# EAGLE design Raspi_Photometer (EAGLE 7.3.0)
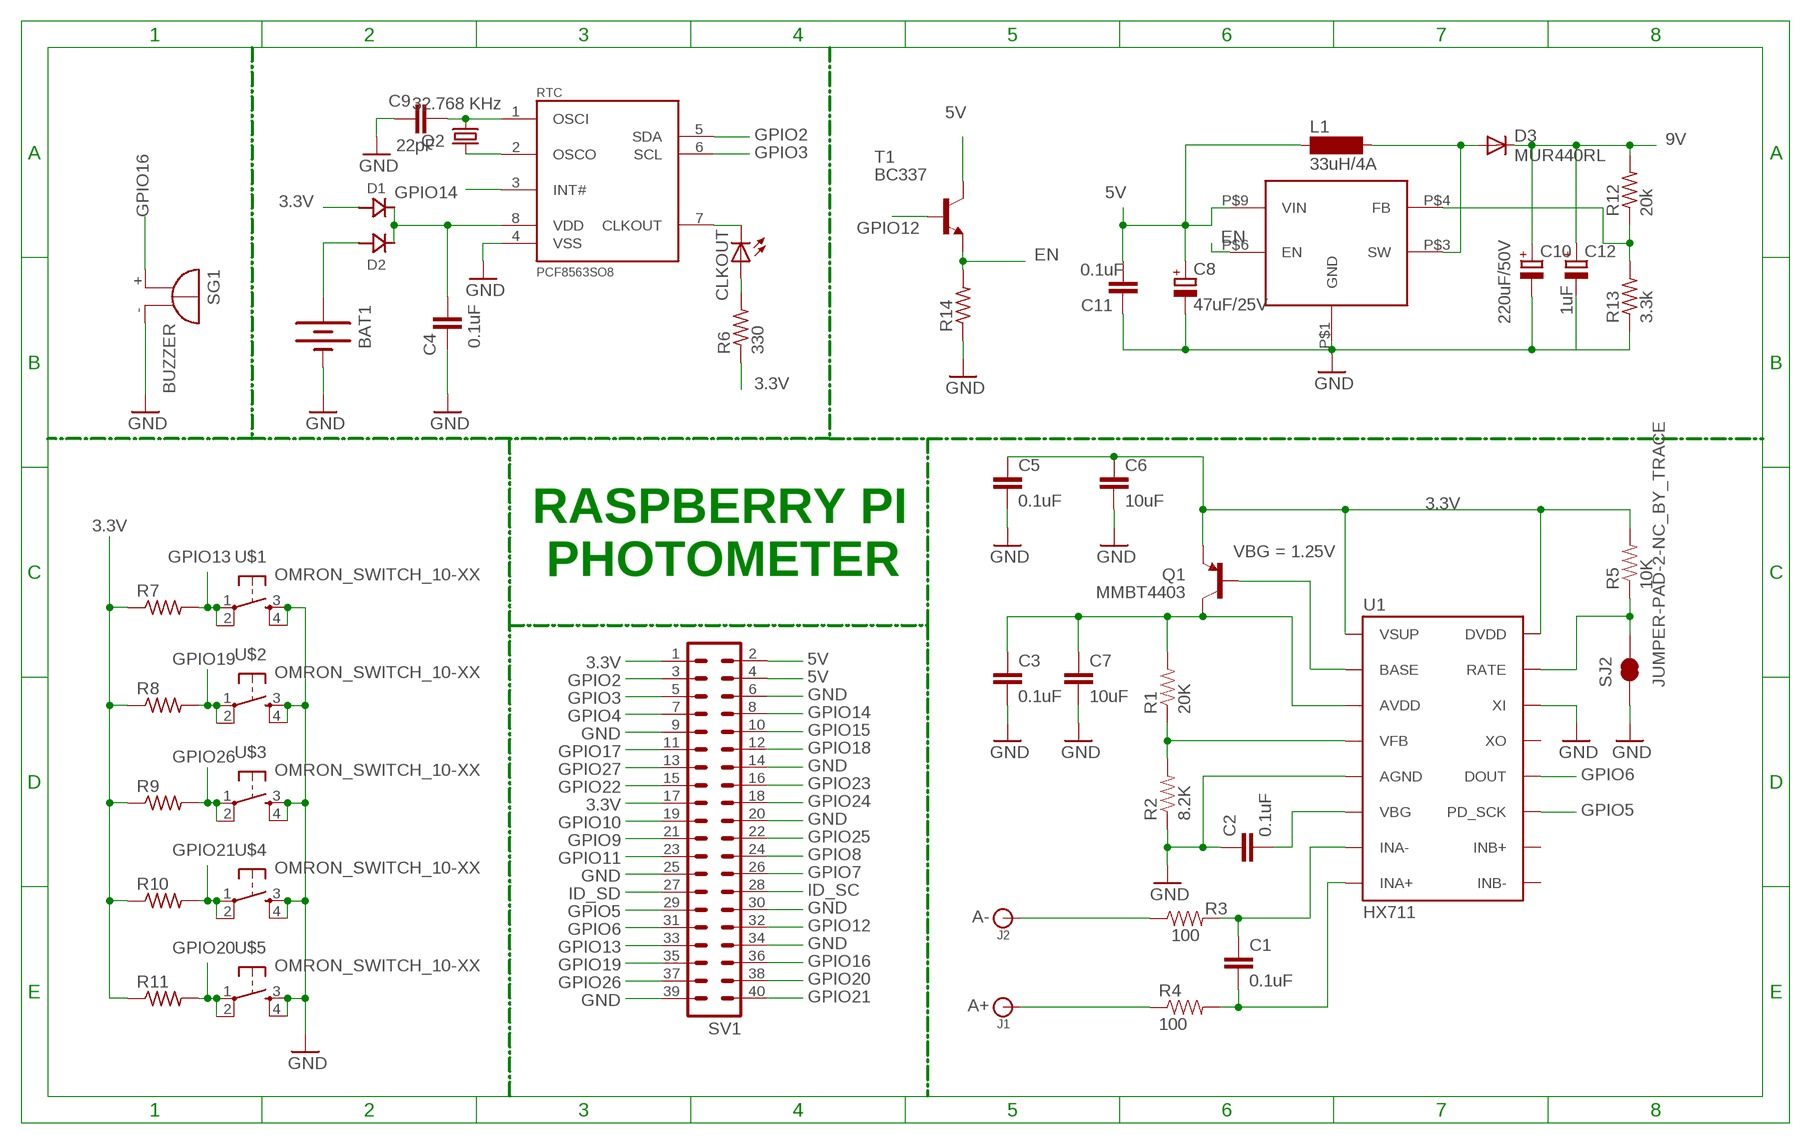
[diagram p0: schematic, sheet 1]

## Parts
BAT1  BATTERY20PTH  [BATTCOM_20MM_PTH]
C1  0.1uF  0.1UF-25V-5%(0603)  [0603-CAP]
C2  0.1uF  0.1UF-25V-5%(0603)  [0603-CAP]
C3  0.1uF  0.1UF-25V-5%(0603)  [0603-CAP]
C4  0.1uF  C-EUC0805K  [C0805K]
C5  0.1uF  0.1UF-25V-5%(0603)  [0603-CAP]
C6  10uF  10UF50V20%(1210)  [1210]
C7  10uF  10UF50V20%(1210)  [1210]
C8  47uF/25V  CPOL-EUE3.5-10  [E3,5-10]
C9  22pF  C-EUC0805K  [C0805K]
C10  220uF/50V  CPOL-EUE5-10.5  [E5-10,5]
C11  0.1uF  C-EUC0603  [C0603]
C12  1uF  CPOL-EUE2.5-5  [E2,5-5]
CLKOUT  LED0805  [CHIPLED_0805]
D1  SS14  [DO214]
D2  SS14  [DO214]
D3  MUR440RL  [C2673]
J1  BANANA_CONN  [BANANA_CONN]
J2  BANANA_CONN  [BANANA_CONN]
L1  33uH/4A  MS85  [MS85]
Q1  MMBT4403  TRANSISTOR_PNPMMBT4403  [SOT23-3]
Q2  32.768 KHz  CRYSTALTC26H  [TC26H]
R1  20K  20KOHM1/10W1%(0603)  [0603-RES]
R2  8.2K  8.2KOHM-1/10W-5%(0603)  [0603-RES]
R3  100  100OHM-1/10W-1%(0603)  [0603-RES]
R4  100  100OHM-1/10W-1%(0603)  [0603-RES]
R5  10K  10KOHM-1/10W-1%(0603)0603  [0603-RES]
R6  330  R-US_0204/7  [0204/7]
R7  R-US_0204/7  [0204/7]
R8  R-US_0204/7  [0204/7]
R9  R-US_0204/7  [0204/7]
R10  R-US_0204/7  [0204/7]
R11  R-US_0204/7  [0204/7]
R12  20k  RESISTOR0207/7  [0207/7]
R13  3.3k  RESISTOR0207/7  [0207/7]
R14  R-US_0207/10  [0207/10]
RTC  PCF8563SO8  [SOIC8]
SG1  BUZZER  [F/TMB]
SJ2  JUMPER-PAD-2-NC_BY_TRACE  [PAD-JUMPER-2-NC_BY_TRACE_YES_SILK]
SV1  ML40  [ML40]
T1  BC337  [TO92]
U1  HX711  HX711HX711  [SO16]
U$1  OMRON_SWITCH_10-XX  [B3F-10XX]
U$2  OMRON_SWITCH_10-XX  [B3F-10XX]
U$3  OMRON_SWITCH_10-XX  [B3F-10XX]
U$4  OMRON_SWITCH_10-XX  [B3F-10XX]
U$5  OMRON_SWITCH_10-XX  [B3F-10XX]
U$6  XL6009  [TO-263-5L]

## Nets
3.3V: C5.1 C6.1 D1.ANODE Q1.2(E) R5.2 R6.1 R7.1 R8.1 R9.1 R10.1 R11.1 SV1.1 SV1.17 U1.1(VSUP) U1.16(DVDD)
5V: C8.+ C11.2 L1.1 SV1.2 SV1.4 T1.3(C) U$6.P$9(VIN)
9V: C10.+ C12.+ D3.C R12.2
A+: J1.P$2 R4.1
A-: J2.P$2 R3.1
E+: C3.1 C7.1 Q1.3(C) R1.2 U1.3(AVDD)
EN: R14.2 T1.1(E) U$6.P$6(EN)
GND: BAT1.2(-) C2.1 C3.2 C4.1 C5.2 C6.2 C7.2 C8.- C9.1 C10.- C11.1 C12.- R2.1 R13.1 R14.1 RTC.4(VSS) SG1.- SJ2.1 SV1.6 SV1.9 SV1.14 SV1.20 SV1.25 SV1.30 SV1.34 SV1.39 U1.5(AGND) U1.14(XI) U$1.3(S) U$1.4(S1) U$2.3(S) U$2.4(S1) U$3.3(S) U$3.4(S1) U$4.3(S) U$4.4(S1) U$5.3(S) U$5.4(S1) U$6.P$1(GND)
GPIO2: RTC.5(SDA) SV1.3
GPIO3: RTC.6(SCL) SV1.5
GPIO4: SV1.7
GPIO5: SV1.29 U1.11(PD_SCK)
GPIO6: SV1.31 U1.12(DOUT)
GPIO7: SV1.26
GPIO8: SV1.24
GPIO9: SV1.21
GPIO10: SV1.19
GPIO11: SV1.23
GPIO12: SV1.32 T1.2(B)
GPIO13: R7.2 SV1.33 U$1.1(P) U$1.2(P1)
GPIO14: RTC.3(INT#) SV1.8
GPIO15: SV1.10
GPIO16: SG1.+ SV1.36
GPIO17: SV1.11
GPIO18: SV1.12
GPIO19: R8.2 SV1.35 U$2.1(P) U$2.2(P1)
GPIO20: R11.2 SV1.38 U$5.1(P) U$5.2(P1)
GPIO21: R10.2 SV1.40 U$4.1(P) U$4.2(P1)
GPIO22: SV1.15
GPIO23: SV1.16
GPIO24: SV1.18
GPIO25: SV1.22
GPIO26: R9.2 SV1.37 U$3.1(P) U$3.2(P1)
GPIO27: SV1.13
ID_SC: SV1.28
ID_SD: SV1.27
N$1: R5.1 SJ2.2 U1.15(RATE)
N$2: C1.1 R3.2 U1.7(INA-)
N$3: C1.2 R4.2 U1.8(INA+)
N$4: Q1.1(B) U1.2(BASE)
N$5: BAT1.1(+) D2.ANODE
N$6: R1.1 R2.2 U1.4(VFB)
N$7: C2.2 U1.6(VBG)
N$8: C4.2 D1.CATHODE D2.CATHODE RTC.8(VDD)
N$9: CLKOUT.C RTC.7(CLKOUT)
N$10: CLKOUT.A R6.2
N$11: C9.2 Q2.1 RTC.1(OSCI)
N$12: Q2.2 RTC.2(OSCO)
N$14: D3.A L1.2 U$6.P$3(SW)
N$16: R12.1 R13.2 U$6.P$4(FB)
Unconnected: U1.9(INB-) U1.10(INB+) U1.13(XO)

## Notes on the sheet
- VBG = 1.25V
- RASPBERRY PI 
   PHOTOMETER

## Library data of the parts
BAT1 = SparkFun-Electromechanical:BATTERY: Battery Holders Various common sizes : AA, AAA, 20mm coin cell and 12mm coin cell. 20MM_4LEGS, BATT-10373
C1-C3 C5 = SparkFun-Capacitors:0.1UF-25V-5%(0603): CAP-08604; PROD_ID: CAP-08604
C4 C9 C11 = rcl:C-EU: CAPACITOR, European symbol
C6 C7 = SparkFun-Capacitors:10UF50V20%(1210): CAP-09824; PROD_ID: CAP-09824
C8 C10 = rcl:CPOL-EU: POLARIZED CAPACITOR, European symbol
C12 = rcl (2):CPOL-EU: POLARIZED CAPACITOR, European symbol
CLKOUT = CEDT_2016_V1:LED
D1 D2 = ihpcb-diode:SS14
D3 = diode:MUR440RL: DIODE ultra-fast recovery rectifier, Vrrm = 40 V, 4 A
J1 J2 = SparkFun-Connectors:BANANA_CONN: Through-hole banana jack
L1 = inductor-neosid:MS85: INDUCTOR SMD power inductor; OC_FARNELL: unknown; OC_NEWARK: unknown
Q1 = SparkFun-DiscreteSemi:TRANSISTOR_PNP: Generic PNP BJT Double check pinouts against datasheets- not all devices are the same! MMBT3906 - 40V 200mA SOT-23 (TRANS-08052) MMBT4403 - 40V 600mA SOT-23 (TRANS-09245); PROD_ID: TRANS-09245
Q2 = CEDT_JANUARY_2015_v5:CRYSTAL: Crystals Various standard crystals. Proven footprints. Spark Fun Electronics SKU : COM-00534
R1 = SparkFun-Resistors:20KOHM1/10W1%(0603): RES-09383; PROD_ID: RES-09383; VALUE: 20k
R2 = SparkFun-Resistors:8.2KOHM-1/10W-5%(0603): RES-10646; PROD_ID: RES-10646
R3 R4 = SparkFun-Resistors:100OHM-1/10W-1%(0603): RES-07863; PROD_ID: RES-07863
R5 = SparkFun-Resistors:10KOHM-1/10W-1%(0603): RES-00824; PROD_ID: RES-00824
R6-R11 R14 = rcl:R-US_: RESISTOR, American symbol
R12 R13 = CEDTv83 (2):RESISTOR
RTC = CEDT_SEPTEMBER_V2:PCF8563
SG1 = CEDT_JANUARY_2015_v5:BUZZER: BUZZER Source: Buerklin; OC_FARNELL: unknown; OC_NEWARK: unknown
SJ2 = SparkFun-Passives:JUMPER-PAD-2-NC_BY_TRACE
SV1 = con-ml:ML40: HARTING; OC_FARNELL: unknown; OC_NEWARK: unknown
T1 = transistor:BC337: NPN TRANSISTOR
U1 = Testing:HX711; PROD_ID: IC-12445
U$1-U$5 = CEDT_JANUARY_2015_v5:OMRON_SWITCH
U$6 = XL6009:XL6009

## Net classes
1 power: width 0.61 mm

## Board
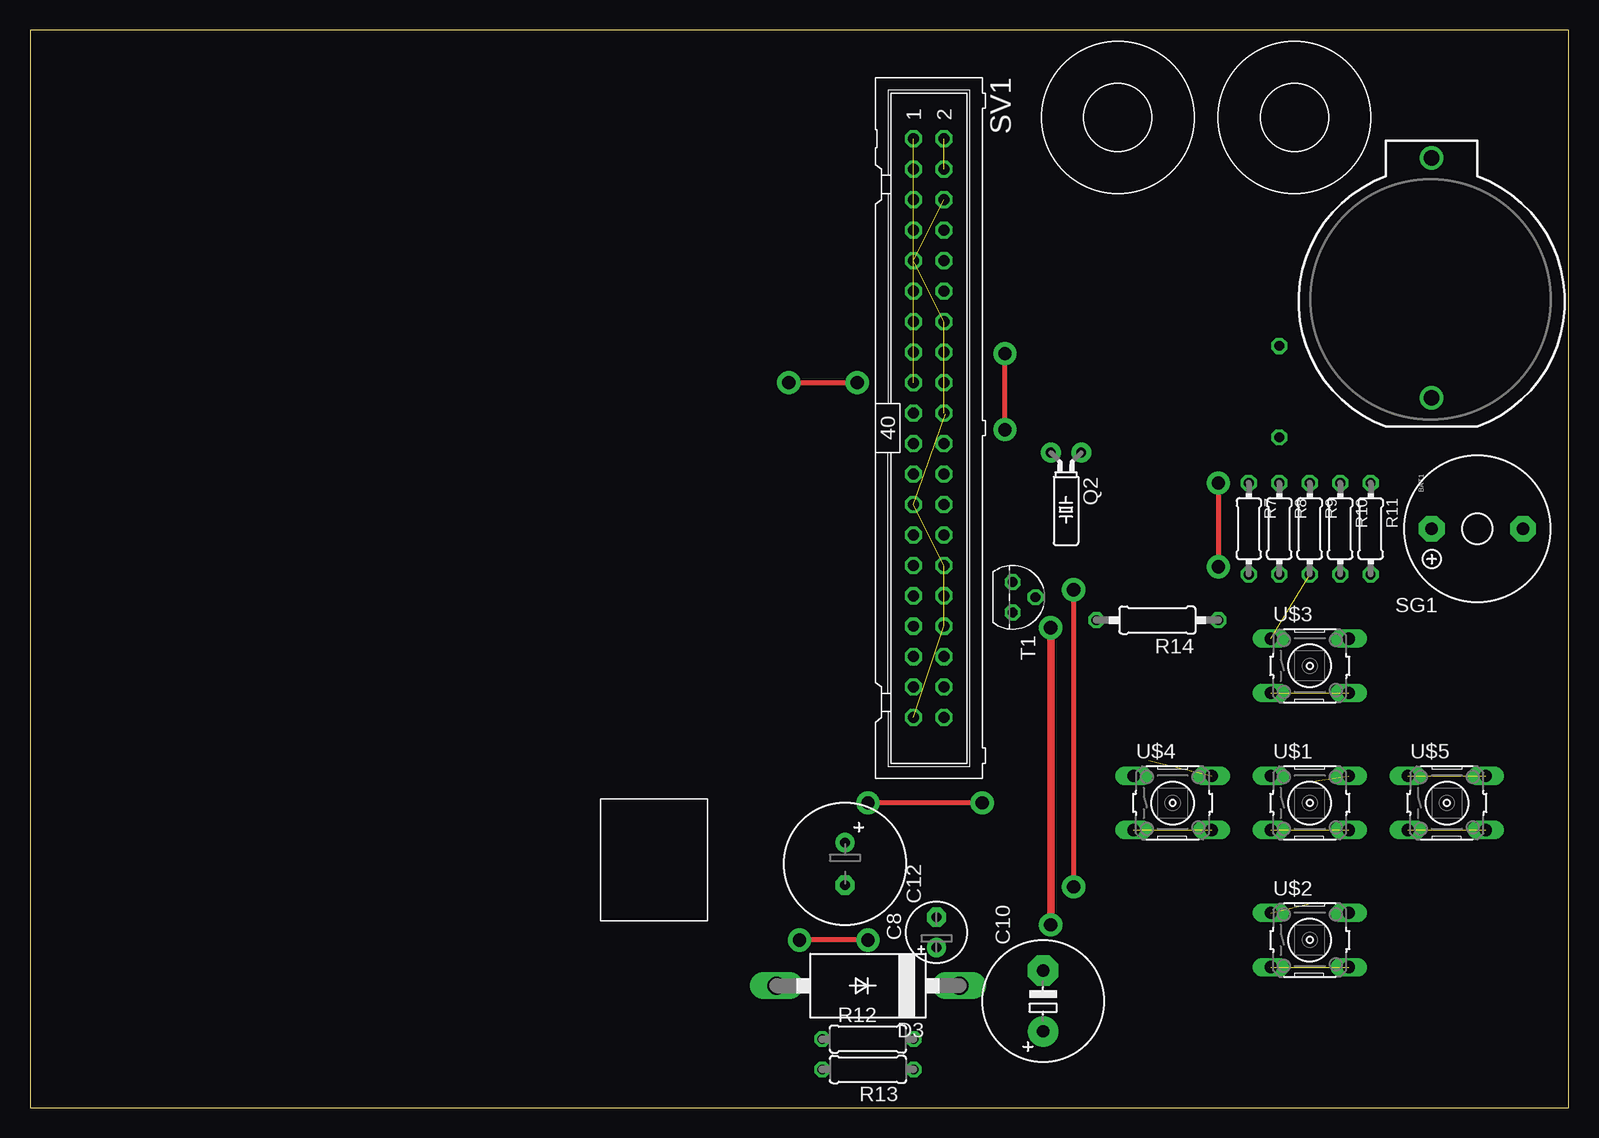
[diagram p1: board, top side]
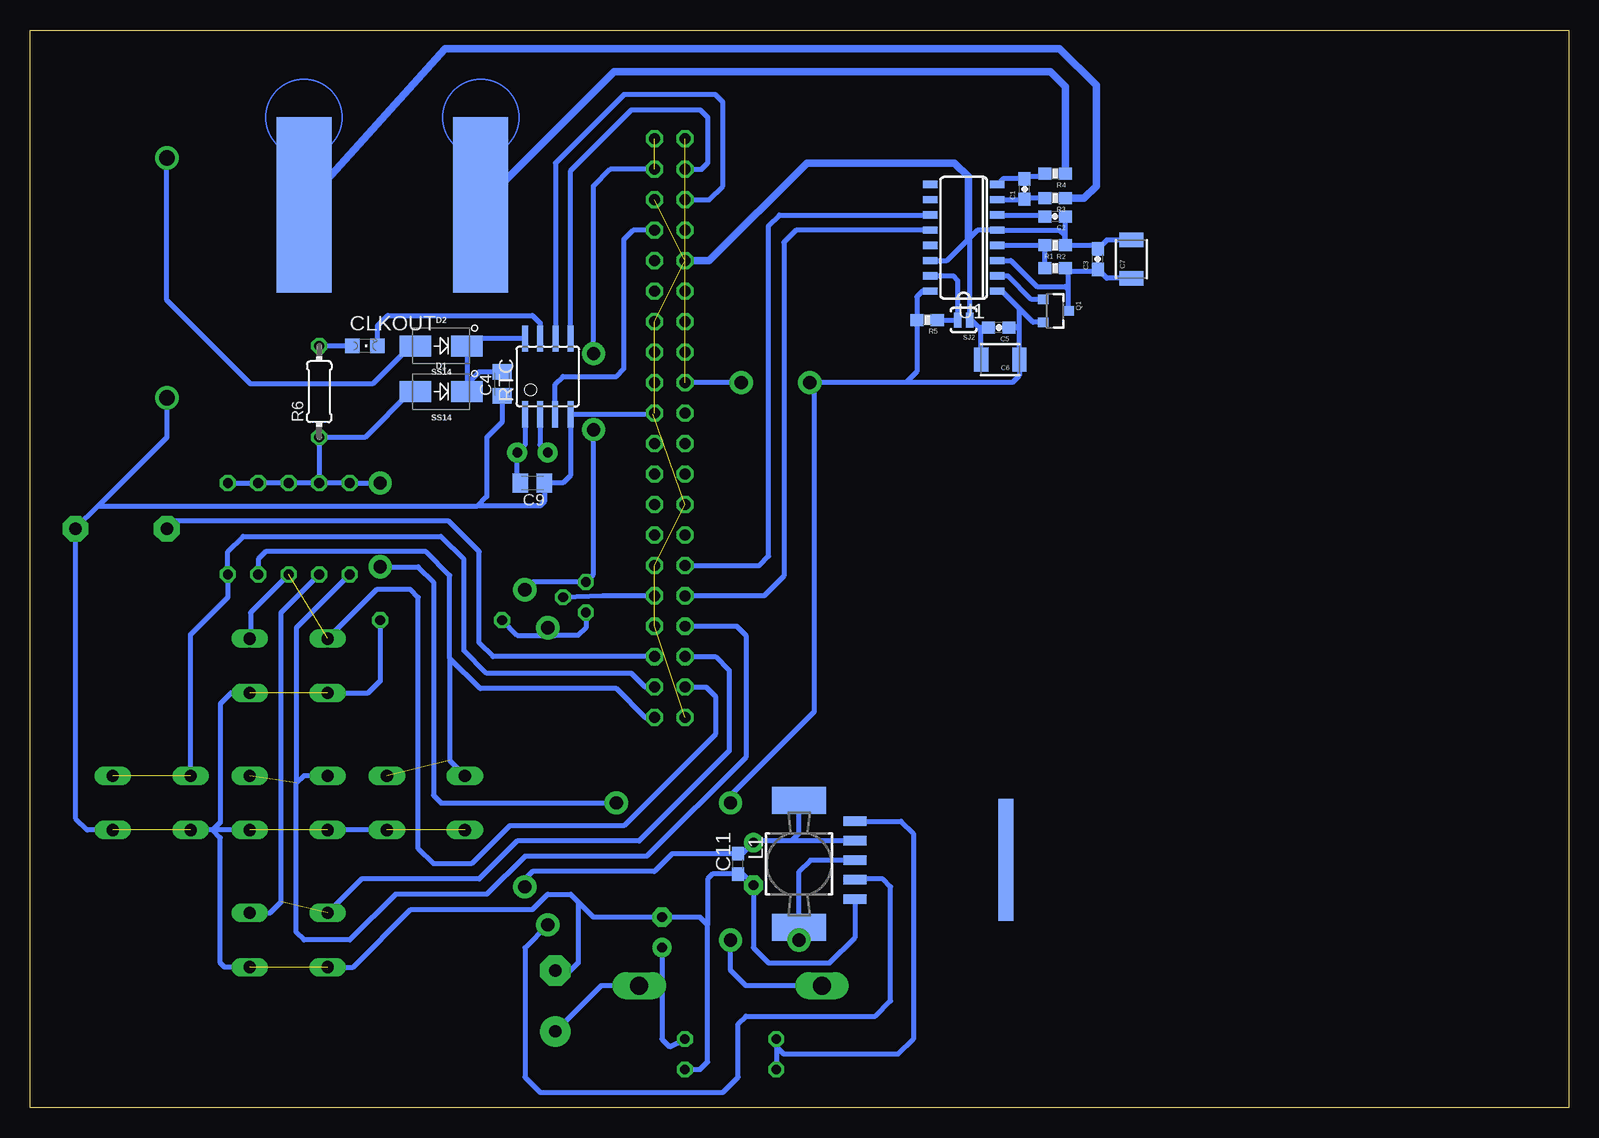
[diagram p2: board, bottom side, seen from below]

Size 128.25 x 89.84 mm. Coordinates in mm from the lower left corner, seen from the top.
Outline: 0,0 128.25,0 128.25,89.84 0,89.84 0,0
Copper layers (1*16): Top 0.035mm / dielectric 1.5mm / Bottom 0.035mm
Design rules "default": minimum track width 10mil, minimum drill 24mil, track to track 8mil, track to pad 8mil, pad to pad 8mil, via to via 8mil, smd to smd 8mil, copper to edge 40mil, drill to drill 8mil, minimum pad ring 10mil, minimum via ring 8mil, stop-mask expansion 4mil, vias tented up to drill 0mil, thermal gap 10mil

### Footprints (pad centres in the part's own frame; a part is rotated, then mirrored left to right if it is on the bottom)
BATTCOM_20MM_PTH = drill 1.3: 1 11.85,0; 2 -8.15,0
0603-CAP = smd 1.1 x 1: 1 -0.85,0; 2 0.85,0
C0805K = smd 1.3 x 1.6: 1 -1,0; 2 1,0
1210 = smd 1.2 x 2: 1 -1.6,0; 2 1.6,0
E3,5-10 = drill 0.813 pad 1.6: + -1.778,0 | drill 0.813 pad 1.6 octagon: - 1.778,0
E5-10,5 = drill 1.016 pad 2.54: + -2.54,0 | drill 1.016 pad 2.54 octagon: - 2.54,0
C0603 = smd 1.1 x 1: 1 -0.85,0; 2 0.85,0
E2,5-5 = drill 0.813 pad 1.6: + -1.27,0 | drill 0.813 pad 1.6 octagon: - 1.27,0
CHIPLED_0805 = smd 1.2 x 1.2: A 0,-1.05; C 0,1.05
DO214 = smd 2.65 x 1.75: ANODE -2.15,0; CATHODE 2.15,0
C2673 = drill 1.499 long: A 7.62,0; C -7.62,0
BANANA_CONN = smd 14.605 x 4.572 bottom: P$2 7.303,0
MS85 = smd 4.5 x 2.25: 1 0,-5.288; 2 0,5.288
SOT23-3 = smd 0.8 x 0.9: 1 -0.95,-1; 2 0.95,-1; 3 0,1.1
TC26H = drill 0.813 pad 1.676: 1 -1.27,0; 2 1.27,0
0603-RES = smd 1.1 x 1: 1 -0.85,0; 2 0.85,0
0204/7 = drill 0.813 octagon: 1 -3.81,0; 2 3.81,0
0207/7 = drill 0.813 octagon: 1 -3.81,0; 2 3.81,0
0207/10 = drill 0.813 octagon: 1 -5.08,0; 2 5.08,0
SOIC8 = smd 0.5 x 2.2: 1 -1.905,-3.154; 2 -0.645,-3.154; 3 0.625,-3.154; 4 1.895,-3.154; 5 1.905,3.154; 6 0.635,3.154; 7 -0.635,3.154; 8 -1.905,3.154
F/TMB = drill 1.016 pad 2.159 octagon: + 3.81,0; - -3.81,0
PAD-JUMPER-2-NC_BY_TRACE_YES_SILK = smd 0.635 x 1.27: 1 -0.508,0; 2 0.508,0
ML40 = drill 0.914 octagon: 1 -24.13,-1.27; 2 -24.13,1.27; 3 -21.59,-1.27; 4 -21.59,1.27; 5 -19.05,-1.27; 6 -19.05,1.27; 7 -16.51,-1.27; 8 -16.51,1.27; 9 -13.97,-1.27; 10 -13.97,1.27; 11 -11.43,-1.27; 12 -11.43,1.27; 13 -8.89,-1.27; 14 -8.89,1.27; 15 -6.35,-1.27; 16 -6.35,1.27; 17 -3.81,-1.27; 18 -3.81,1.27; 19 -1.27,-1.27; 20 -1.27,1.27; 21 1.27,-1.27; 22 1.27,1.27; 23 3.81,-1.27; 24 3.81,1.27; 25 6.35,-1.27; 26 6.35,1.27; 27 8.89,-1.27; 28 8.89,1.27; 29 11.43,-1.27; 30 11.43,1.27; 31 13.97,-1.27; 32 13.97,1.27; 33 16.51,-1.27; 34 16.51,1.27; 35 19.05,-1.27; 36 19.05,1.27; 37 21.59,-1.27; 38 21.59,1.27; 39 24.13,-1.27; 40 24.13,1.27
TO92 = drill 0.813 octagon: 1 1.27,0; 2 0,1.905; 3 -1.27,0
SO16 = smd 0.6 x 1.2: 1 -4.445,-2.8; 2 -3.175,-2.8; 3 -1.905,-2.8; 4 -0.635,-2.8; 5 0.635,-2.8; 6 1.905,-2.8; 7 3.175,-2.8; 8 4.445,-2.8; 9 4.445,2.8; 10 3.175,2.8; 11 1.905,2.8; 12 0.635,2.8; 13 -0.635,2.8; 14 -1.905,2.8; 15 -3.175,2.8; 16 -4.445,2.8
B3F-10XX = drill 1.016 long: 1 -3.251,2.261; 2 3.251,2.261; 3 -3.251,-2.261; 4 3.251,-2.261
TO-263-5L = smd 0.813 x 1.93 bottom: P$1 -0.406,0.838; P$3 2.845,0.838; P$4 6.096,0.838; P$6 1.219,0.838; P$9 4.47,0.838 | smd 10.16 x 1.27 bottom: P$5 2.87,13.437

### Placement (x,y rotation side)
BAT1  116.84,67.31 90 top
C1  45.34,76.58 90 bottom
C2  42.8,74.3 180 bottom
C3  39.24,70.74 90 bottom
C4  88.9,60.33 90 bottom
C5  47.5,65.02 180 bottom
C6  47.37,62.36 180 bottom
C7  36.45,70.74 90 bottom
C8  67.94,20.32 270 top
C9  86.36,52.07 180 bottom
C10  84.45,8.89 90 top
C11  69.22,20.32 90 bottom
C12  75.56,14.61 90 top
CLKOUT  100.33,63.5 270 bottom
D1  93.98,59.69 0 bottom
D2  93.98,63.5 0 bottom
D3  69.85,10.16 180 top
J1  90.68,82.55 270 top
J2  105.41,82.55 270 top
L1  64.14,20.32 180 bottom
Q1  42.8,66.42 270 bottom
Q2  86.36,54.61 180 top
R1  42.8,69.98 0 bottom
R2  42.8,71.88 180 bottom
R3  42.8,75.82 180 bottom
R4  42.8,77.85 180 bottom
R5  53.47,65.66 180 bottom
R6  104.14,59.69 90 bottom
R7  101.6,48.26 270 top
R8  104.14,48.26 270 top
R9  106.68,48.26 270 top
R10  109.22,48.26 270 top
R11  111.76,48.26 270 top
R12  69.85,5.71 0 top
R13  69.85,3.17 180 top
R14  93.98,40.64 180 top
RTC  85.09,60.96 0 bottom
SG1  120.65,48.26 180 top
SJ2  50.42,65.66 180 bottom
SV1  74.93,56.64 270 top
T1  81.92,42.55 270 top
U1  50.42,72.52 90 bottom
U$1  106.68,25.4 0 top
U$2  106.68,13.97 0 top
U$3  106.68,36.83 0 top
U$4  95.25,25.4 0 top
U$5  118.11,25.4 0 top
U$6  60.33,17.78 90 top

### Tracks (layer width: path | path; a pad name or v marks a point on that pad's centre or on a via)
3.3V  (via drill 1.1 pad 1.93)  (1 unrouted)
  Top 0.406: v63.25,60.45 v68.96,60.45 | v99.06,52.07 v99.06,45.09 | v79.38,25.4 v69.85,25.4
  Bottom 0.406: U1.16 53.85,68.07 54.32,67.6 R5.2 54.32,61.38 55.24,60.45 | 47.71,67.98 U1.1 47.24,68.07 45.77,66.6 | 45.77,65.28 C6.1 45.77,61.04 46.35,60.45 55.24,60.45 | 45.77,65.28 45.77,66.6 | Q1.2 44.64,65.47 45.77,66.6 | C5.1 46.02,65.02 45.77,65.28 | v68.96,60.45 SV1.17 | R11.1 R10.1 R9.1 R8.1 | R8.1 R6.1 100.33,55.88 96.52,59.69 D1.ANODE | v99.06,52.07 R7.1 R8.1 | v99.06,45.09 95.89,45.09 94.61,43.81 94.61,26.04 93.98,25.4 v79.38,25.4 | v69.85,25.4 69.85,26.04 62.87,33.02 62.87,60.07 v63.25,60.45 55.24,60.45
5V  (via drill 1.1 pad 1.93)  (1 unrouted)
  Top 0.406: v81.28,56.52 v81.28,62.87 | v87,43.18 v87,18.41
  Bottom 0.406: v81.28,56.52 81.28,44.45 T1.3 86.36,43.81 v87,43.18 | v81.28,62.87 81.28,76.83 79.88,78.23 SV1.4 | L1.1 64.14,22.86 64.16,22.86 64.77,22.25 | U$6.P$9 64.77,22.25 | 64.77,22.25 67.79,22.25 C8.+ 68.87,21.17 C11.2 74.72,21.17 76.2,19.68 86.36,19.68 87,19.05 v87,18.41
9V
  Bottom 0.406: C10.+ 80.64,10.16 D3.C 76.2,10.16 75.56,10.79 | C12.+ 75.56,10.79 | 75.56,10.79 75.56,5.71 74.93,5.08 R12.2
A+
  Bottom 0.61: R4.1 41.95,85.13 43.18,86.36 79.57,86.36 J1.P$2
A-
  Bottom 0.61: R3.1 40.39,75.82 39.37,76.83 39.37,85.22 42.42,88.27 93.66,88.27 J2.P$2
E+
  Bottom 0.406: U1.3 46.48,70.61 44.32,68.45 41.95,68.45 41.7,68.2 | Q1.3 41.7,68.2 | 41.7,68.2 41.7,69.73 | 41.7,69.73 R1.2 | 41.7,69.73 39.41,69.73 C3.1 38.49,69.14 C7.1
EN  (via drill 1.1 pad 1.93)
  Top 0.61: v85.09,40.01 v85.09,15.24
  Bottom 0.406: T1.1 81.92,40.01 82.55,39.37 83.82,39.37 84.45,39.37 | R14.2 87.63,39.37 84.45,39.37 | 84.45,39.37 v85.09,40.01 | v85.09,15.24 87,13.34 87,2.54 85.72,1.27 70.48,1.27 69.22,2.54 69.22,6.99 68.58,7.62 57.78,7.62 56.52,8.89 56.52,18.41 57.15,19.05 59.44,19.05 U$6.P$6
GND  (12 unrouted)
  Bottom 0.406: U1.14 51.82,70.61 50.04,72.39 49.91,72.52 | R2.1 41.95,71.92 | R2.1 C2.1 | R2.1 42.04,72.22 42.04,72.77 42.42,73.15 U1.5 49.28,73.15 49.91,72.52 | R2.1 39.54,71.88 C3.2 38.49,72.34 C7.2 | C6.2 48.97,64.85 49.15,65.02 | C5.2 49.15,65.02 | 49.15,65.02 49.78,65.66 SJ2.1 49.91,72.52 | U$4.4 U$1.3 | U$1.4 113.03,23.14 | 113.03,23.14 U$5.3 | U$3.4 111.48,34.57 112.39,33.66 112.39,23.77 113.03,23.14 | U$2.4 112.04,11.71 112.39,12.06 112.39,22.5 113.03,23.14 | U$5.4 123.47,23.14 124.46,24.13 SG1.- 122.56,50.16 | SV1.20 76.31,57.81 RTC.4 83.19,52.7 83.82,52.07 C9.1 85.36,50.53 85.72,50.16 90.93,50.16 | C4.1 88.9,57.15 90.17,55.88 90.17,50.93 90.93,50.16 | BAT1.2 116.84,55.88 122.56,50.16 | 122.56,50.16 90.93,50.16 | U$6.P$1 59.49,14.17 61.59,12.06 66.67,12.06 67.94,13.34 C8.- 68.87,19.47 C11.1 71.33,19.47 71.75,19.05 71.75,15.24 | R14.1 99.06,35.56 100.05,34.57 U$3.3 | R13.1 72.39,3.17 71.75,3.81 71.75,15.24 | 71.75,15.24 72.39,15.88 C12.- 81.28,15.88 82.55,17.14 | U$2.3 101.32,11.71 96.52,16.51 86.36,16.51 85.09,17.78 83.19,17.78 82.55,17.14 | 82.55,17.14 82.55,12.06 83.19,11.43 C10.-
  Bottom 0.61: SV1.9 71.63,70.61 63.5,78.74 51.18,78.74 50.04,77.6 50.04,72.39
GPIO2
  Bottom 0.406: RTC.5 83.19,78.11 78.11,83.19 72.39,83.19 71.75,82.55 71.75,78.74 72.26,78.23 SV1.3
GPIO3
  Bottom 0.406: SV1.5 71.63,75.69 70.48,76.83 70.48,83.82 71.12,84.45 78.74,84.45 84.45,78.74 RTC.6
GPIO5
  Bottom 0.406: SV1.29 67.44,45.21 66.67,45.97 66.67,73.53 65.79,74.42 U1.11
GPIO6
  Bottom 0.406: U1.12 64.39,73.15 65.41,72.14 65.41,44.32 67.06,42.67 SV1.31
GPIO12
  Bottom 0.406: SV1.32 80.52,42.67 T1.2
GPIO13  (1 unrouted)
  Bottom 0.406: SV1.33 69.34,40.13 68.58,39.37 68.58,29.21 76.83,20.95 87,20.95 90.17,17.78 97.79,17.78 101.6,13.97 105.41,13.97 106.05,14.61 106.05,27.05 | 106.05,27.05 105.41,27.69 103.45,27.69 U$1.1 | 106.05,27.05 106.05,40.01 R7.2
GPIO14
  Bottom 0.406: RTC.3 84.47,60.31 83.82,60.96 79.38,60.96 78.74,61.59 78.74,72.39 77.98,73.15 SV1.8
GPIO16
  Bottom 0.406: SG1.+ 116.2,48.9 93.34,48.9 90.81,46.35 90.81,38.73 89.66,37.59 SV1.36
GPIO19  (1 unrouted)
  Bottom 0.406: SV1.35 71.12,37.59 69.98,36.45 69.98,29.72 77.47,22.23 87.63,22.23 90.81,19.05 100.61,19.05 U$2.1 103.33,16.13 | U$2.2 108.23,16.23 107.31,17.14 107.31,41.27 R8.2
GPIO20  (1 unrouted)
  Bottom 0.406: U$5.1 114.86,39.45 111.76,42.55 R11.2 111.76,46.35 110.49,47.62 93.98,47.62 92.08,45.72 92.08,38.1 90.17,36.2 78.11,36.2 76.96,35.05 SV1.38
GPIO21  (1 unrouted)
  Bottom 0.406: 93.27,37.47 93.27,44.37 95.25,46.35 108.58,46.35 109.22,45.72 R10.2 | SV1.40 76.96,32.51 79.38,34.92 90.73,34.92 93.27,37.47 | 93.27,37.47 93.27,28.93 U$4.1
GPIO26  (1 unrouted)
  Bottom 0.406: SV1.37 71.88,35.05 71.12,34.29 71.12,31.11 78.74,23.5 88.27,23.5 91.44,20.32 94.61,20.32 95.89,21.59 95.89,42.55 96.52,43.18 99.34,43.18 U$3.1 | R9.2 109.86,41.27 109.86,39.17 U$3.2
N$1
  Bottom 0.406: R5.1 SJ2.2 50.93,68.96 51.31,69.34 U1.15
N$2
  Bottom 0.406: R3.2 45.25,75.82 C1.1 45.38,75.69 U1.7
N$3
  Bottom 0.406: R4.2 43.81,77.85 44.07,77.6 45.17,77.6 C1.2 47.15,77.43 U1.8
N$4
  Bottom 0.406: 47.56,69.4 U1.2 46.74,69.34 44.77,67.37 Q1.1
N$5
  Bottom 0.406: D2.ANODE 96.52,63.5 99.69,60.33 109.86,60.33 116.84,67.31 BAT1.1
N$6
  Bottom 0.406: R1.1 R2.2 U1.4
N$7
  Bottom 0.406: U1.6 43.78,74.42 C2.2
N$8
  Bottom 0.406: RTC.8 91.22,64.11 D2.CATHODE 91.83,60.33 | 91.83,60.33 D1.CATHODE | C4.2 90.83,61.33 91.83,60.33
N$9
  Bottom 0.406: CLKOUT.C 99.28,65.19 98.42,66.04 86.36,66.04 85.72,65.41 RTC.7
N$10
  Bottom 0.406: CLKOUT.A R6.2
N$11
  Bottom 0.406: RTC.1 87,55.24 Q2.1 87.63,52.07 C9.2
N$12
  Bottom 0.406: RTC.2 85.73,55.26 Q2.2
N$14  (via drill 1.1 pad 1.93)
  Top 0.406: v69.85,13.97 v64.14,13.97
  Bottom 0.406: U$6.P$3 63.2,20.62 64.14,19.68 L1.2 v64.14,13.97 | D3.A 68.58,10.16 69.85,11.43 v69.85,13.97
N$16
  Bottom 0.406: R12.1 66.04,5.08 | 66.04,5.08 R13.2 | U$6.P$4 55.63,23.88 54.61,22.86 54.61,5.71 55.88,4.45 65.41,4.45 66.04,5.08